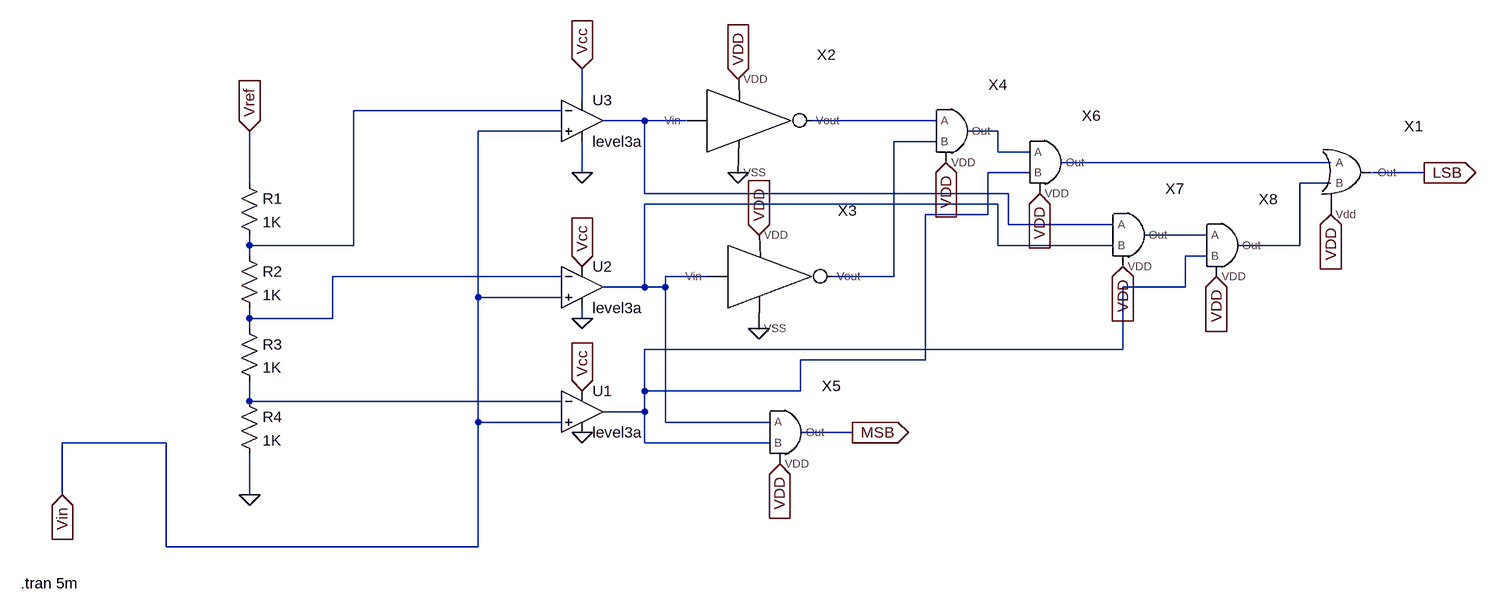
[diagram p0: schematic 2flashADC.asc]
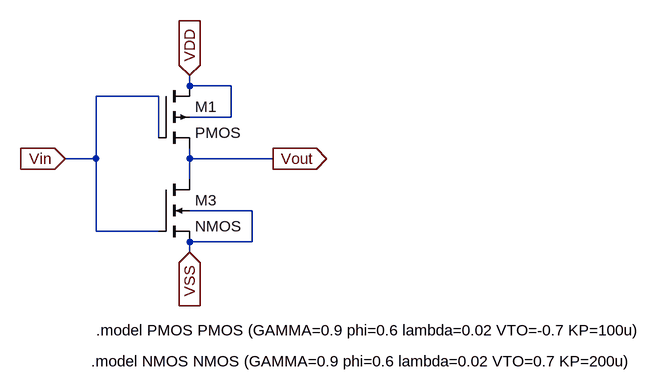
[diagram p1: sub-circuit inverter.asc]
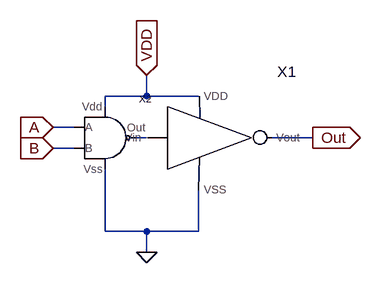
[diagram p2: sub-circuit and_t.asc]
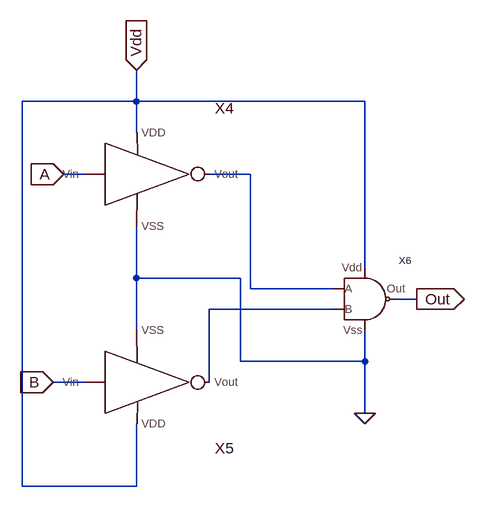
[diagram p3: sub-circuit or_t.asc]
2flashADC.asc, the LTspice schematic file:
Version 4
SHEET 1 2688 1108
WIRE 240 16 240 -32
WIRE 208 32 -112 32
WIRE 336 48 272 48
WIRE 400 48 336 48
WIRE 784 48 592 48
WIRE 208 64 80 64
WIRE 880 64 832 64
WIRE 784 80 720 80
WIRE 880 96 880 64
WIRE 928 96 880 96
WIRE 1392 112 976 112
WIRE 240 128 240 80
WIRE 928 128 864 128
WIRE 1536 128 1456 128
WIRE -272 144 -272 64
WIRE 1392 144 1344 144
WIRE 336 160 336 48
WIRE 896 160 336 160
WIRE 880 176 336 176
WIRE 864 192 864 128
WIRE 864 192 768 192
WIRE 896 208 896 160
WIRE 1056 208 896 208
WIRE 1200 224 1104 224
WIRE -272 240 -272 224
WIRE -112 240 -112 32
WIRE -112 240 -272 240
WIRE 880 240 880 176
WIRE 1056 240 880 240
WIRE 1344 240 1344 144
WIRE 1344 240 1248 240
WIRE -272 256 -272 240
WIRE 1200 256 1168 256
WIRE 208 288 -144 288
WIRE 432 288 368 288
WIRE 720 288 720 80
WIRE 720 288 624 288
WIRE 336 304 336 176
WIRE 336 304 272 304
WIRE 368 304 368 288
WIRE 368 304 336 304
WIRE 1168 304 1168 256
WIRE 1168 304 1072 304
WIRE 80 320 80 64
WIRE 208 320 80 320
WIRE -272 352 -272 336
WIRE -144 352 -144 288
WIRE -144 352 -272 352
WIRE 240 352 240 336
WIRE -272 368 -272 352
WIRE 1072 400 1072 304
WIRE 1072 400 336 400
WIRE 768 416 768 192
WIRE 768 416 576 416
WIRE 336 464 336 400
WIRE 576 464 576 416
WIRE 576 464 336 464
WIRE -272 480 -272 448
WIRE 208 480 -272 480
WIRE 336 496 336 464
WIRE 336 496 272 496
WIRE 80 512 80 320
WIRE 208 512 80 512
WIRE 368 512 368 304
WIRE 528 512 368 512
WIRE 656 528 576 528
WIRE -400 544 -560 544
WIRE 336 544 336 496
WIRE 528 544 336 544
WIRE -560 624 -560 544
WIRE -272 624 -272 560
WIRE -400 704 -400 544
WIRE 80 704 80 512
WIRE 80 704 -400 704
FLAG -272 624 0
FLAG 240 528 0
FLAG 240 352 0
FLAG 240 128 0
FLAG 240 -32 Vcc
IOPIN 240 -32 In
FLAG 240 272 Vcc
IOPIN 240 272 In
FLAG 240 464 Vcc
IOPIN 240 464 In
FLAG -272 64 Vref
IOPIN -272 64 In
FLAG 1536 128 LSB
IOPIN 1536 128 Out
FLAG 656 528 MSB
IOPIN 656 528 Out
FLAG -560 624 Vin
IOPIN -560 624 In
FLAG 480 128 0
FLAG 480 -16 VDD
IOPIN 480 -16 In
FLAG 544 576 VDD
IOPIN 544 576 In
FLAG 512 368 0
FLAG 512 224 VDD
IOPIN 512 224 In
FLAG 800 112 VDD
IOPIN 800 112 In
FLAG 944 160 VDD
IOPIN 944 160 In
FLAG 1072 272 VDD
IOPIN 1072 272 In
FLAG 1216 288 VDD
IOPIN 1216 288 In
FLAG 1392 192 VDD
IOPIN 1392 192 In
SYMBOL res -288 128 R0
SYMATTR InstName R1
SYMATTR Value 1K
SYMBOL res -288 240 R0
SYMATTR InstName R2
SYMATTR Value 1K
SYMBOL res -288 352 R0
SYMATTR InstName R3
SYMATTR Value 1K
SYMBOL res -288 464 R0
SYMATTR InstName R4
SYMATTR Value 1K
SYMBOL OpAmps\\UniversalOpAmp3 240 496 R0
SYMATTR InstName U1
SYMBOL OpAmps\\UniversalOpAmp3 240 304 R0
SYMATTR InstName U2
SYMBOL OpAmps\\UniversalOpAmp3 240 48 R0
SYMATTR InstName U3
SYMBOL INVERTER 432 48 R0
SYMATTR InstName X2
SYMBOL INVERTER 464 288 R0
SYMATTR InstName X3
SYMBOL AND_T 880 64 R0
SYMATTR InstName X4
SYMBOL AND_T 624 528 R0
SYMATTR InstName X5
SYMBOL AND_T 1024 112 R0
SYMATTR InstName X6
SYMBOL AND_T 1152 224 R0
SYMATTR InstName X7
SYMBOL AND_T 1296 240 R0
SYMATTR InstName X8
SYMBOL OR_T 1520 128 R0
SYMATTR InstName X1
TEXT -624 760 Left 2 !.tran 5m

inverter.asc, the sub-circuit schematic file:
Version 4
SHEET 1 984 680
WIRE 112 32 112 16
WIRE 176 32 112 32
WIRE 64 48 -32 48
WIRE 176 80 176 32
WIRE 176 80 112 80
WIRE 64 112 64 48
WIRE -32 144 -32 48
WIRE -32 144 -80 144
WIRE 112 144 112 128
WIRE 240 144 112 144
WIRE 112 176 112 144
WIRE 208 224 112 224
WIRE -32 256 -32 144
WIRE 64 256 -32 256
WIRE 208 272 208 224
WIRE 208 272 112 272
WIRE 112 288 112 272
FLAG -80 144 Vin
IOPIN -80 144 In
FLAG 240 144 Vout
IOPIN 240 144 Out
FLAG 112 16 VDD
IOPIN 112 16 In
FLAG 112 288 VSS
IOPIN 112 288 In
SYMBOL pmos4 64 32 R0
SYMATTR InstName M1
SYMATTR Value2 l=1u w=50u
SYMBOL nmos4 64 176 R0
SYMATTR InstName M3
SYMATTR Value2 l=1u w=100u
TEXT -32 408 Left 2 !.model PMOS PMOS (GAMMA=0.9 phi=0.6 lambda=0.02 VTO=-0.7 KP=100u)
TEXT -40 456 Left 2 !.model NMOS NMOS (GAMMA=0.9 phi=0.6 lambda=0.02 VTO=0.7 KP=200u)

and_t.asc, the sub-circuit schematic file:
Version 4
SHEET 1 880 680
WIRE 160 96 160 64
WIRE 160 96 96 96
WIRE 240 96 160 96
WIRE 96 112 96 96
WIRE 48 144 16 144
WIRE 160 160 144 160
WIRE 416 160 352 160
WIRE 48 176 16 176
WIRE 96 304 96 208
WIRE 160 304 96 304
WIRE 240 304 240 240
WIRE 240 304 160 304
WIRE 160 336 160 304
FLAG 416 160 Out
IOPIN 416 160 Out
FLAG 16 144 A
IOPIN 16 144 In
FLAG 16 176 B
IOPIN 16 176 In
FLAG 160 64 VDD
IOPIN 160 64 In
FLAG 160 336 0
SYMBOL NAND 64 160 R0
SYMATTR InstName X2
SYMBOL INVERTER 192 160 R0
SYMATTR InstName X1

or_t.asc, the sub-circuit schematic file:
Version 4
SHEET 1 880 680
WIRE -416 -224 -416 -272
WIRE -416 -224 -592 -224
WIRE -64 -224 -416 -224
WIRE -416 -176 -416 -224
WIRE -496 -112 -528 -112
WIRE -240 -112 -304 -112
WIRE -64 32 -64 -224
WIRE -416 48 -416 -32
WIRE -256 48 -416 48
WIRE -240 64 -240 -112
WIRE -112 64 -240 64
WIRE 16 80 -16 80
WIRE -112 96 -304 96
WIRE -416 128 -416 48
WIRE -256 176 -256 48
WIRE -64 176 -64 128
WIRE -64 176 -256 176
WIRE -496 208 -544 208
WIRE -304 208 -304 96
WIRE -64 256 -64 176
WIRE -592 368 -592 -224
WIRE -416 368 -416 272
WIRE -416 368 -592 368
FLAG -528 -112 A
IOPIN -528 -112 In
FLAG -544 208 B
IOPIN -544 208 In
FLAG 16 80 Out
IOPIN 16 80 Out
FLAG -416 -272 Vdd
IOPIN -416 -272 In
FLAG -64 256 0
SYMBOL INVERTER -464 -112 R0
SYMATTR InstName X4
SYMBOL INVERTER -464 208 M180
SYMATTR InstName X5
SYMBOL NAND -96 80 R0
SYMATTR InstName X6

The netlist it stands for:
* 2flashADC.asc
R1 Vref N001 1K
R2 N001 N011 1K
R3 N011 N012 1K
R4 N012 0 1K
XU1 Vin N012 Vcc 0 N007 level3a  ; pins In+ In- V+ V- OUT
XU2 Vin N011 Vcc 0 N009 level3a  ; pins In+ In- V+ V- OUT
XU3 Vin N001 Vcc 0 N002 level3a  ; pins In+ In- V+ V- OUT
XX2 VDD N002 0 N003 inverter
XX3 VDD N009 0 N005 inverter
XX4 N003 N005 VDD N004 and_t
XX5 N009 N007 VDD MSB and_t
XX6 N004 N007 VDD N006 and_t
XX7 N002 N009 VDD N010 and_t
XX8 N010 N007 VDD N008 and_t
XX1 N006 N008 VDD LSB or_t

* block symbol definitions
.subckt inverter VDD Vin VSS Vout
M1 VDD Vin Vout VDD PMOS l=1u w=50u
M3 Vout Vin VSS VSS NMOS l=1u w=100u
.model PMOS PMOS (GAMMA=0.9 phi=0.6 lambda=0.02 VTO=-0.7 KP=100u)
.model NMOS NMOS (GAMMA=0.9 phi=0.6 lambda=0.02 VTO=0.7 KP=200u)
.ends inverter

.subckt and_t A B VDD Out
XX2 A B N001 0 VDD NAND  ; pins A B Out Vss Vdd
XX1 VDD N001 0 Out inverter
.ends and_t

.subckt or_t A B Vdd Out
XX4 Vdd A 0 N001 inverter
XX5 Vdd B 0 N002 inverter
XX6 N001 N002 Out 0 Vdd NAND  ; pins A B Out Vss Vdd
.ends or_t

.model NMOS NMOS
.model PMOS PMOS
.lib standard.mos
.tran 5m
.backanno
.end